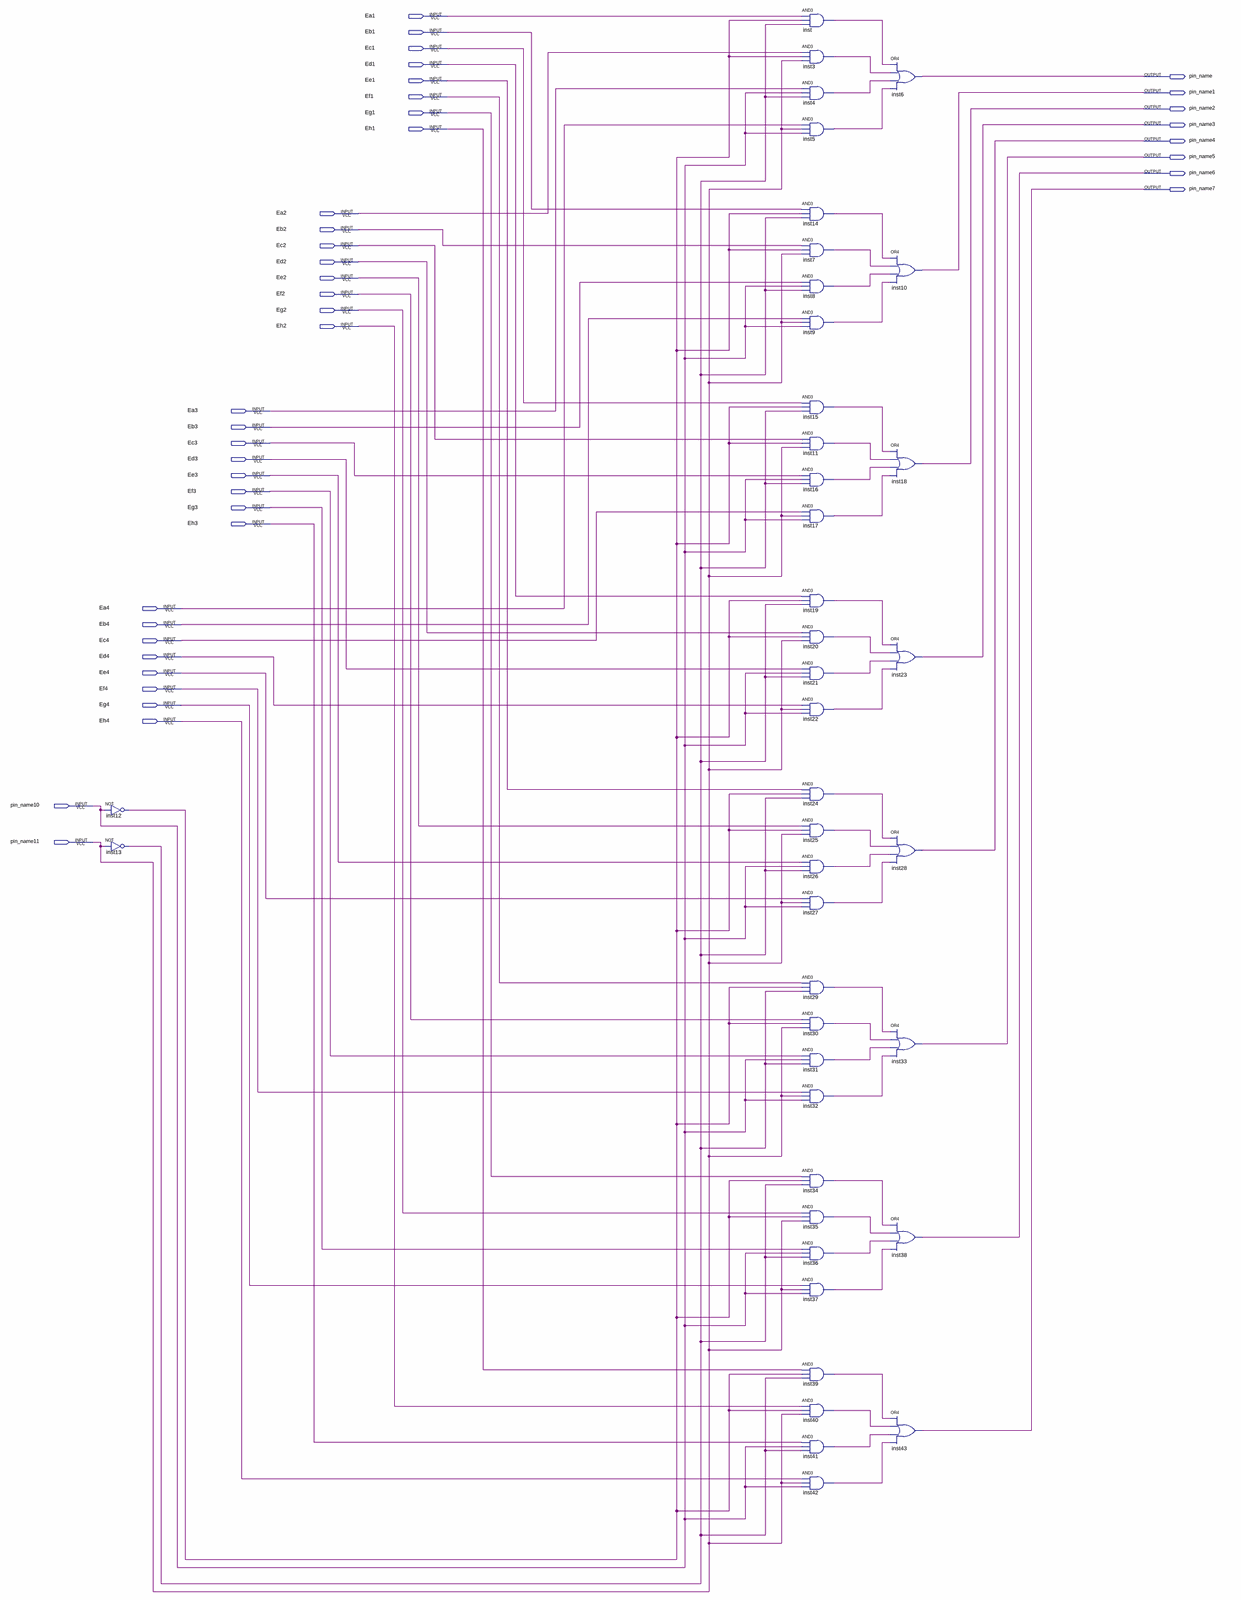
[diagram p0: schematic sheet, whole]
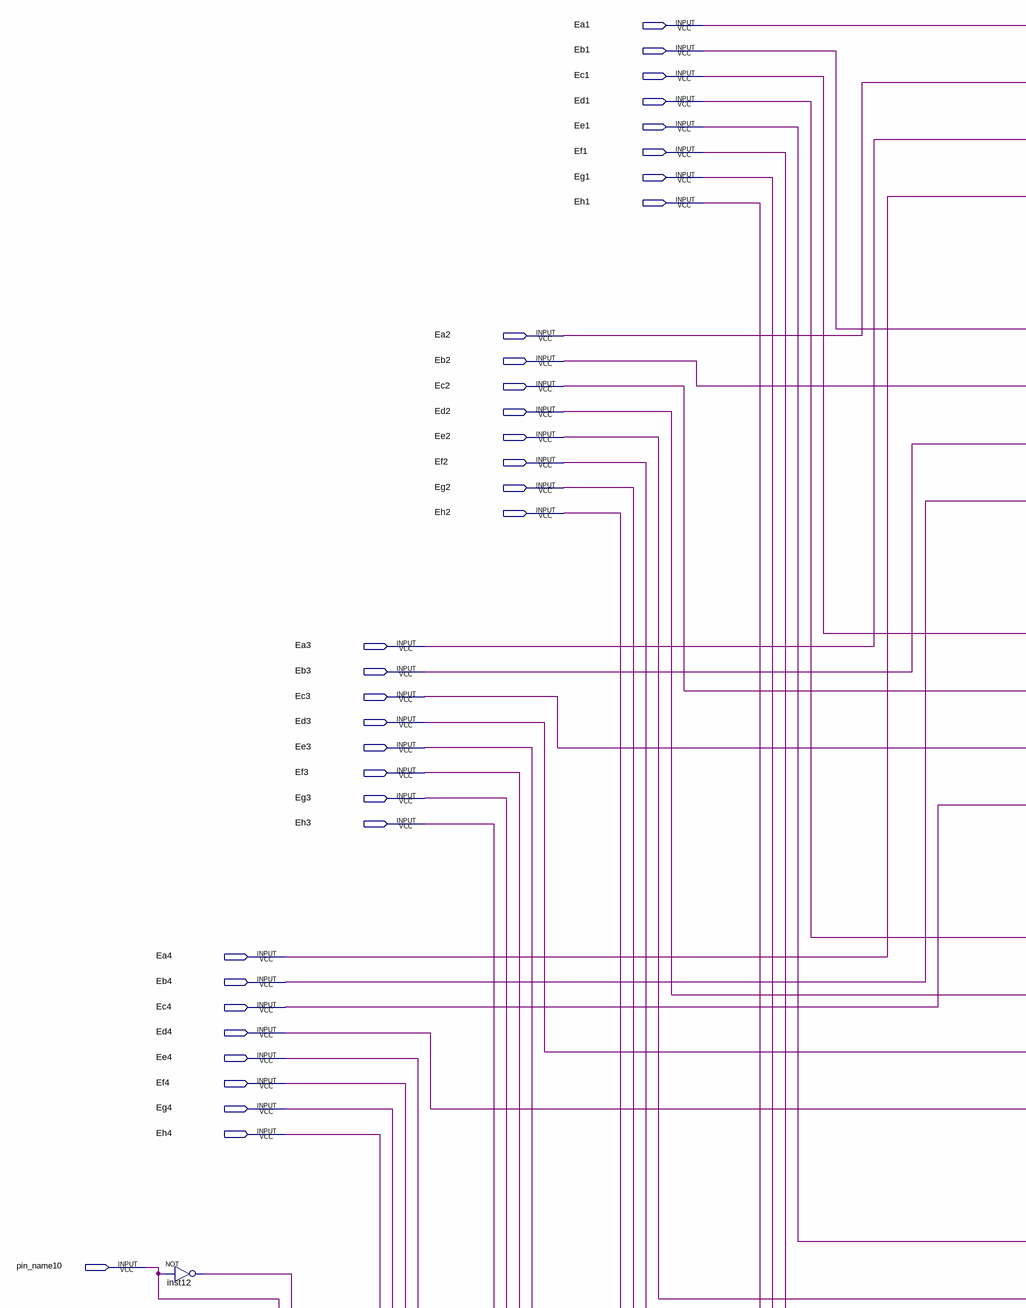
[diagram p1: schematic sheet, upper left part]
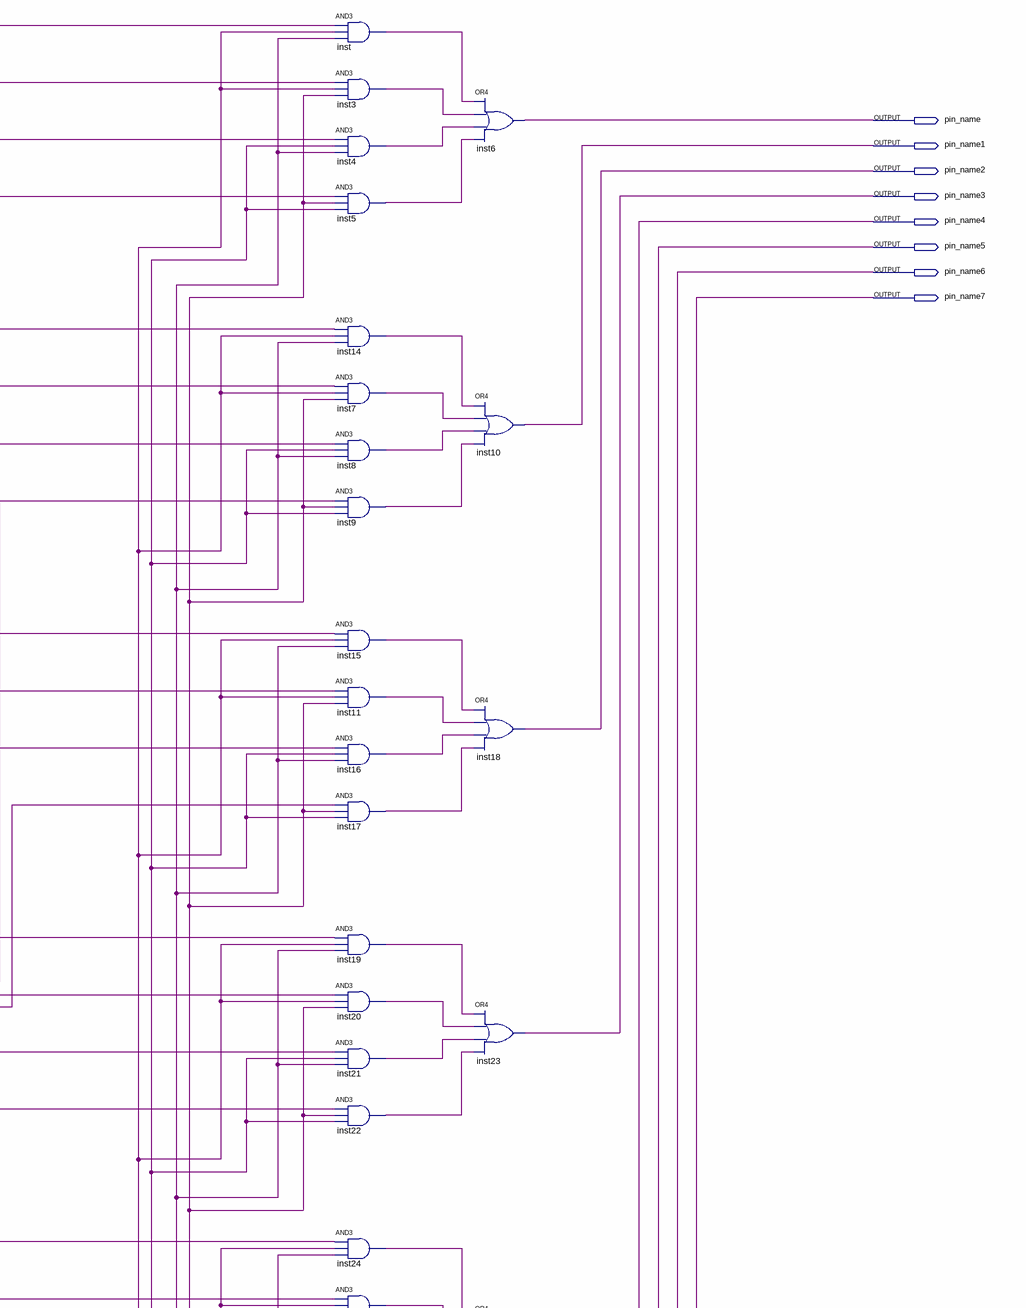
[diagram p2: schematic sheet, upper right part]
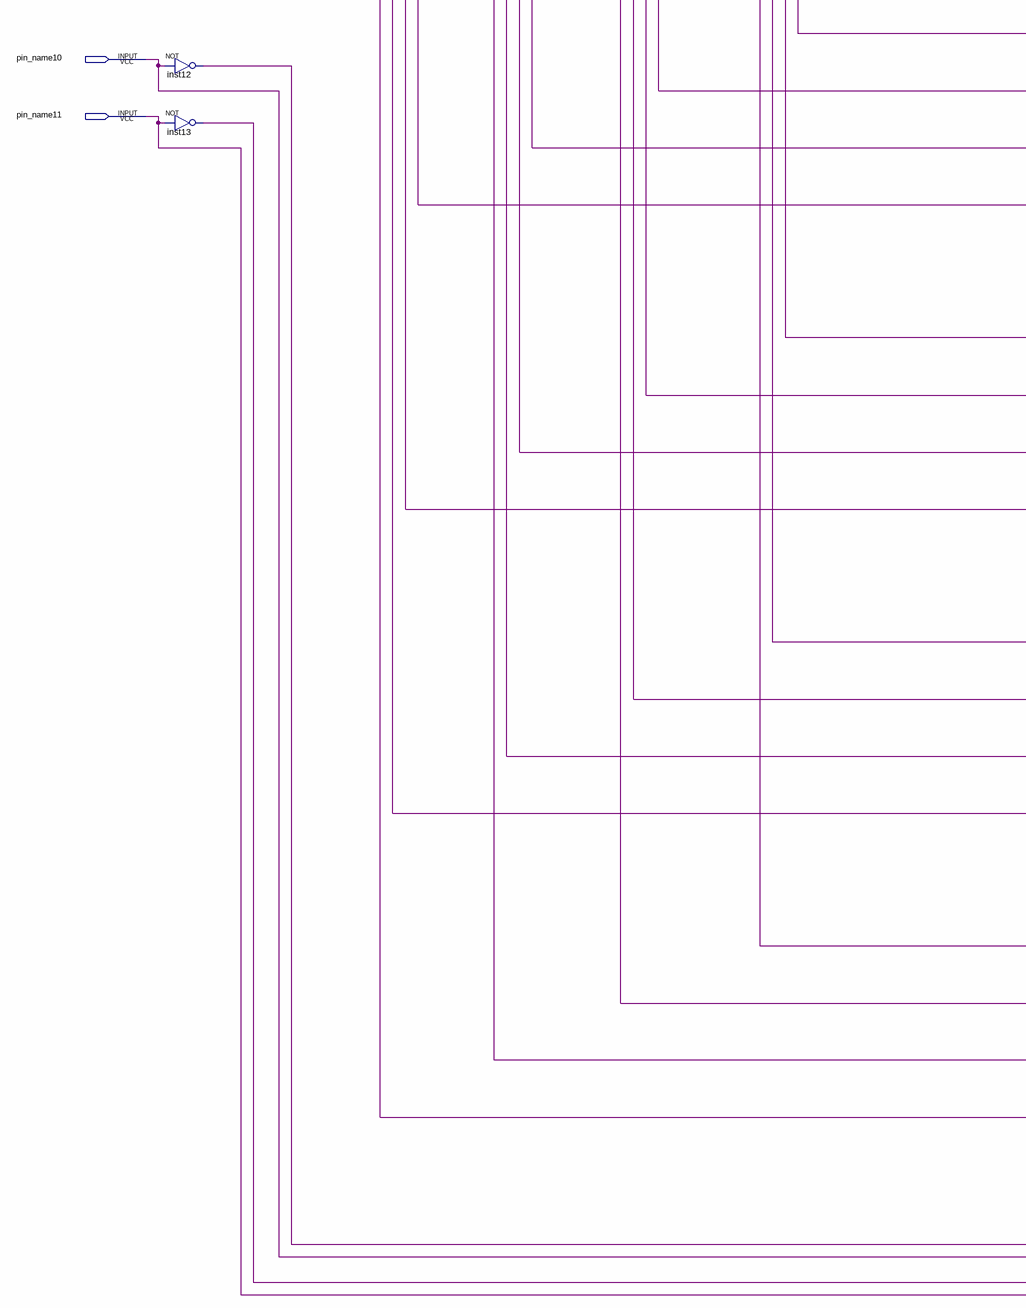
[diagram p3: schematic sheet, lower left part]
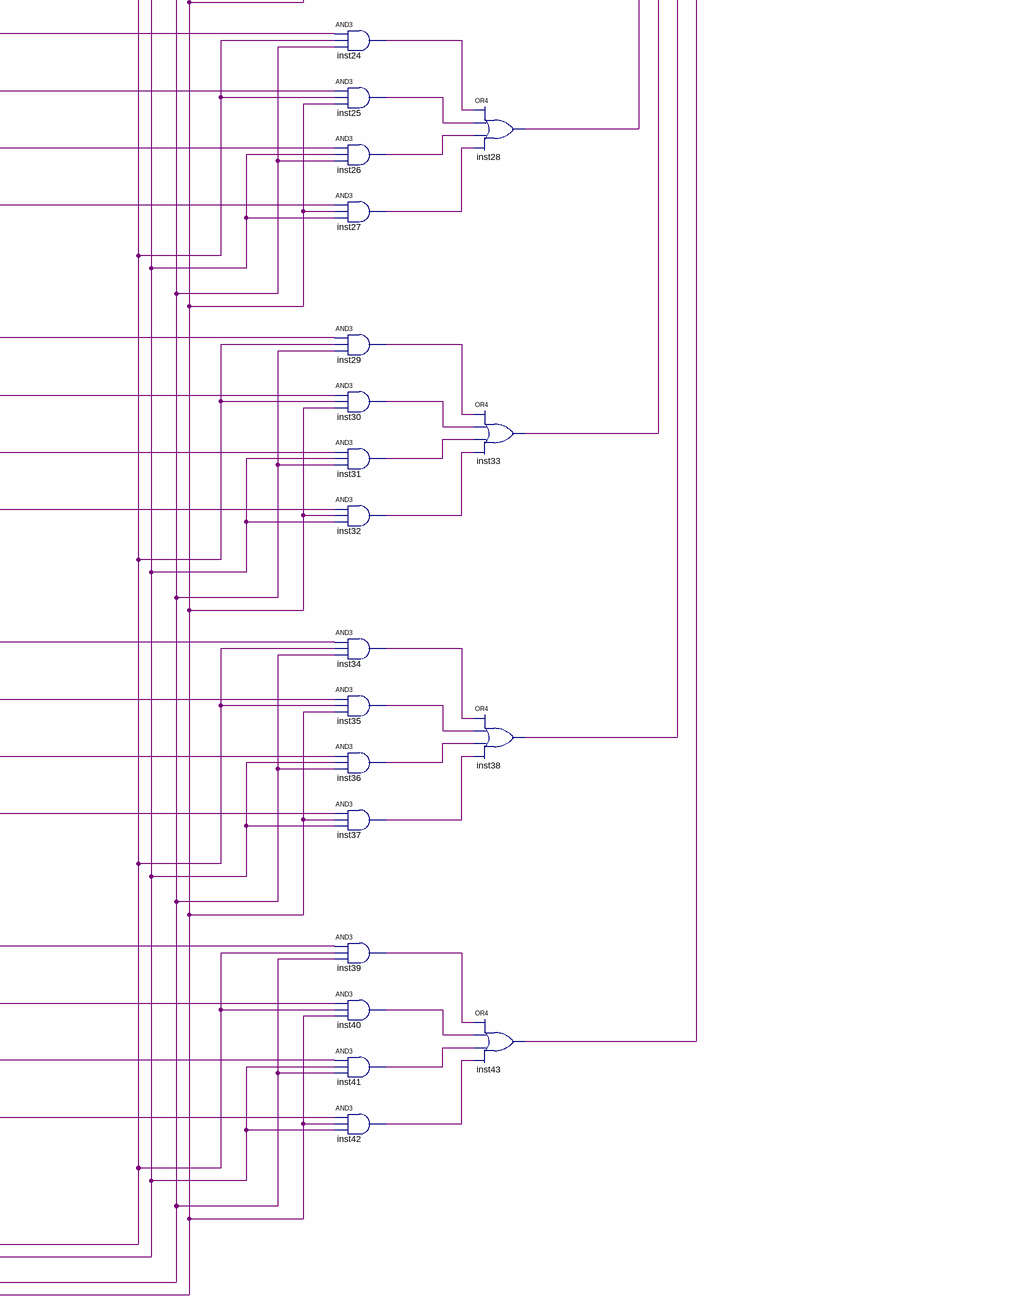
[diagram p4: schematic sheet, lower right part]
// Quartus schematic multiplexador.bdf as structural Verilog: 42 symbols, 42 pins
module multiplexador (
  input  Ea1,
  input  Eb1,
  input  Ec1,
  input  Ed1,
  input  Ee1,
  input  Ef1,
  input  Eg1,
  input  Eh1,
  input  Ea2,
  input  Eb2,
  input  Ec2,
  input  Ed2,
  input  Ee2,
  input  Ef2,
  input  Eg2,
  input  Eh2,
  input  Ea3,
  input  Eb3,
  input  Ec3,
  input  Ed3,
  input  Ee3,
  input  Ef3,
  input  Eg3,
  input  Eh3,
  input  Ea4,
  input  Eb4,
  input  Ec4,
  input  Ed4,
  input  Ee4,
  input  Ef4,
  input  Eg4,
  input  Eh4,
  input  pin_name10,
  input  pin_name11,
  output pin_name,
  output pin_name1,
  output pin_name2,
  output pin_name3,
  output pin_name4,
  output pin_name5,
  output pin_name6,
  output pin_name7
);

  wire inst3_out, inst4_out, inst5_out, inst7_out, inst8_out, inst9_out, inst11_out, inst12_out, inst13_out,
       inst14_out, inst15_out, inst16_out, inst17_out, inst19_out, inst20_out, inst21_out, inst22_out,
       inst24_out, inst25_out, inst26_out, inst27_out, inst29_out, inst30_out, inst31_out, inst32_out,
       inst34_out, inst35_out, inst36_out, inst37_out, inst39_out, inst40_out, inst41_out, inst42_out,
       inst_out;

  not inst12 (inst12_out, pin_name10);
  not inst13 (inst13_out, pin_name11);
  and inst (inst_out, Ea1, inst12_out, inst13_out);
  and inst3 (inst3_out, Ea2, inst12_out, pin_name11);
  and inst4 (inst4_out, Ea3, pin_name10, inst13_out);
  and inst5 (inst5_out, Ea4, pin_name11, pin_name10);
  and inst14 (inst14_out, Eb1, inst12_out, inst13_out);
  and inst7 (inst7_out, Eb2, inst12_out, pin_name11);
  and inst8 (inst8_out, Eb3, pin_name10, inst13_out);
  and inst9 (inst9_out, Eb4, pin_name11, pin_name10);
  and inst15 (inst15_out, Ec1, inst12_out, inst13_out);
  and inst11 (inst11_out, Ec2, inst12_out, pin_name11);
  and inst16 (inst16_out, Ec3, pin_name10, inst13_out);
  and inst17 (inst17_out, Ec4, pin_name11, pin_name10);
  and inst19 (inst19_out, Ed1, inst12_out, inst13_out);
  and inst20 (inst20_out, Ed2, inst12_out, pin_name11);
  and inst21 (inst21_out, Ed3, pin_name10, inst13_out);
  and inst22 (inst22_out, Ed4, pin_name11, pin_name10);
  and inst24 (inst24_out, Ee1, inst12_out, inst13_out);
  and inst25 (inst25_out, Ee2, inst12_out, pin_name11);
  and inst26 (inst26_out, Ee3, pin_name10, inst13_out);
  and inst27 (inst27_out, Ee4, pin_name11, pin_name10);
  and inst29 (inst29_out, Ef1, inst12_out, inst13_out);
  and inst30 (inst30_out, Ef2, inst12_out, pin_name11);
  and inst31 (inst31_out, Ef3, pin_name10, inst13_out);
  and inst32 (inst32_out, Ef4, pin_name11, pin_name10);
  and inst34 (inst34_out, Eg1, inst12_out, inst13_out);
  and inst35 (inst35_out, Eg2, inst12_out, pin_name11);
  and inst36 (inst36_out, Eg3, pin_name10, inst13_out);
  and inst37 (inst37_out, Eg4, pin_name11, pin_name10);
  and inst39 (inst39_out, Eh1, inst12_out, inst13_out);
  and inst40 (inst40_out, Eh2, inst12_out, pin_name11);
  and inst41 (inst41_out, Eh3, pin_name10, inst13_out);
  and inst42 (inst42_out, Eh4, pin_name11, pin_name10);
  or inst6 (pin_name, inst_out, inst3_out, inst4_out, inst5_out);
  or inst10 (pin_name1, inst14_out, inst7_out, inst8_out, inst9_out);
  or inst18 (pin_name2, inst15_out, inst11_out, inst16_out, inst17_out);
  or inst23 (pin_name3, inst19_out, inst20_out, inst21_out, inst22_out);
  or inst28 (pin_name4, inst24_out, inst25_out, inst26_out, inst27_out);
  or inst33 (pin_name5, inst29_out, inst30_out, inst31_out, inst32_out);
  or inst38 (pin_name6, inst34_out, inst35_out, inst36_out, inst37_out);
  or inst43 (pin_name7, inst39_out, inst40_out, inst41_out, inst42_out);
endmodule
